# Altium schematic sheet LCD.SchDoc
size B
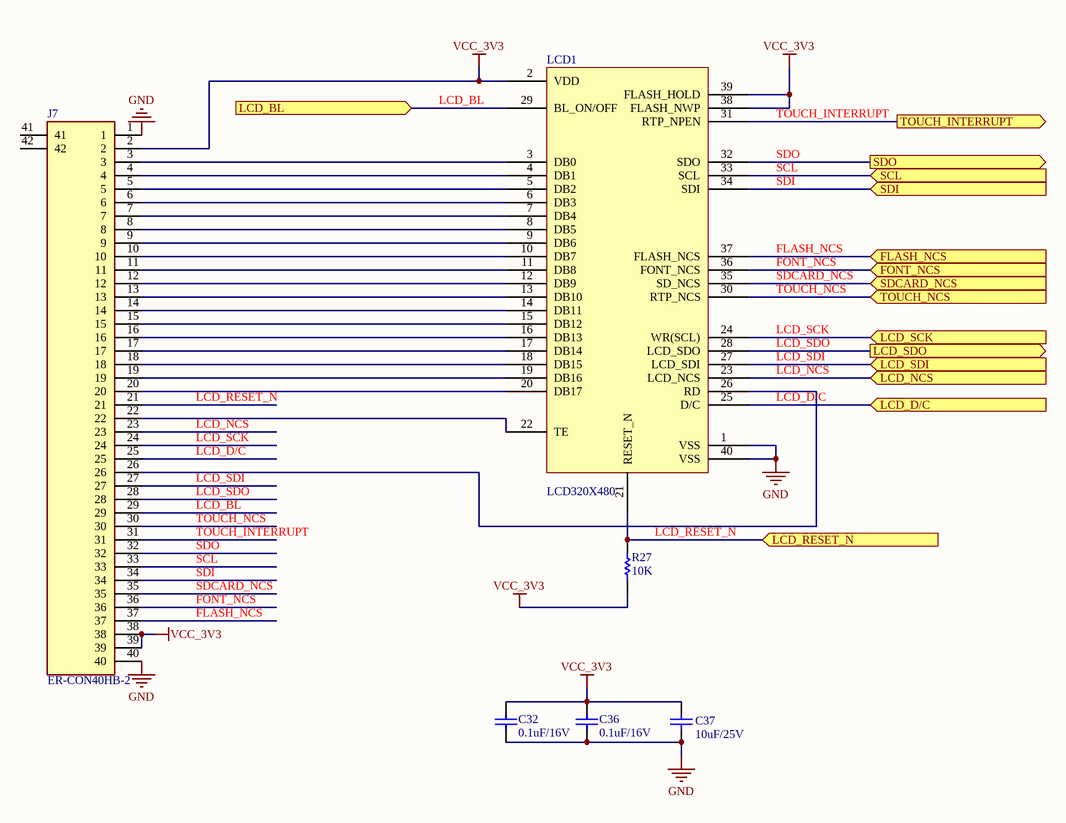
[diagram p0: LCD.SchDoc]

## Parts
C32  0.1uF/16V  [0603C]
C36  0.1uF/16V  [0603C]
C37  10uF/25V  [0805C]
J7  ER-CON40HB-2  [ERCON40HB2]
LCD1  LCD320X480  [HDR2X20]
R27  10K  [0603R]

## Ports
FLASH_NCS (in), FONT_NCS (in), LCD_BL (in), LCD_D/C (in), LCD_NCS (in), LCD_RESET_N (in), LCD_SCK (in), LCD_SDI (in), LCD_SDO (out), SCL (in), SDCARD_NCS (in), SDI (in), SDO (out), TOUCH_INTERRUPT (out), TOUCH_NCS (in)

## Nets
GND: C32.2 C36.2 C37.1 J7.1 J7.40 LCD1.1(VSS) LCD1.40(VSS)
VCC_3V3: C32.1 C36.1 C37.2 J7.2 J7.38 J7.39 LCD1.2(VDD) LCD1.38(FLASH_NWP) LCD1.39(FLASH_HOLD) R27.2
FLASH_NCS: J7.37 LCD1.37(FLASH_NCS) ; port FLASH_NCS
FONT_NCS: J7.36 LCD1.36(FONT_NCS) ; port FONT_NCS
LCD_BL: J7.29 LCD1.29(BL_ON/OFF) ; port LCD_BL
LCD_D/C: J7.25 LCD1.25(D/C) ; port LCD_D/C
LCD_NCS: J7.23 LCD1.23(LCD_NCS) ; port LCD_NCS
LCD_RESET_N: J7.21 LCD1.21(RESET_N) R27.1 ; port LCD_RESET_N
LCD_SCK: J7.24 LCD1.24(WR(SCL)) ; port LCD_SCK
LCD_SDI: J7.27 LCD1.27(LCD_SDI) ; port LCD_SDI
LCD_SDO: J7.28 LCD1.28(LCD_SDO) ; port LCD_SDO
SCL: J7.33 LCD1.33(SCL) ; port SCL
SDCARD_NCS: J7.35 LCD1.35(SD_NCS) ; port SDCARD_NCS
SDI: J7.34 LCD1.34(SDI) ; port SDI
SDO: J7.32 LCD1.32(SDO) ; port SDO
TOUCH_INTERRUPT: J7.31 LCD1.31(RTP_NPEN) ; port TOUCH_INTERRUPT
TOUCH_NCS: J7.30 LCD1.30(RTP_NCS) ; port TOUCH_NCS
NetJ7_3: J7.3 LCD1.3(DB0)
NetJ7_4: J7.4 LCD1.4(DB1)
NetJ7_5: J7.5 LCD1.5(DB2)
NetJ7_6: J7.6 LCD1.6(DB3)
NetJ7_7: J7.7 LCD1.7(DB4)
NetJ7_8: J7.8 LCD1.8(DB5)
NetJ7_9: J7.9 LCD1.9(DB6)
NetJ7_10: J7.10 LCD1.10(DB7)
NetJ7_11: J7.11 LCD1.11(DB8)
NetJ7_12: J7.12 LCD1.12(DB9)
NetJ7_13: J7.13 LCD1.13(DB10)
NetJ7_14: J7.14 LCD1.14(DB11)
NetJ7_15: J7.15 LCD1.15(DB12)
NetJ7_16: J7.16 LCD1.16(DB13)
NetJ7_17: J7.17 LCD1.17(DB14)
NetJ7_18: J7.18 LCD1.18(DB15)
NetJ7_19: J7.19 LCD1.19(DB16)
NetJ7_20: J7.20 LCD1.20(DB17)
NetJ7_22: J7.22 LCD1.22(TE)
NetJ7_26: J7.26 LCD1.26(RD)

Not connected (* = marked no-connect by the designer): J7 41 42

## Library data of the parts
C32 C36 = Cap: Multilayer Ceramic Capacitors MLCC - SMD/SMT 0603 16VDC 0.1uF 10% X7R AEC-Q2000; Mfr: Taiyo Yuden; Mfr Part No: EMK107B7104KAHT; Package: 0603; Price: 0.101; Stockiest: MOUSER; Stockiest Part No: 963-EMK107B7104KAHT; Value: 0.1uF/16V
C37 = Cap: Multilayer Ceramic Capacitors MLCC - SMD/SMT 0805 25VDC 10uF 20% X5R; Mfr: Taiyo Yuden; Mfr Part No: TMK212BBJ106MG-T; Package: 0805; Price: 0.232; Stockiest: MOUSER; Stockiest Part No: 963-TMK212BBJ106MG-T; Value: 10uF/25V
J7 = ER-CON40HB-2: 40 Pin 1.0mm Pitch Bottom Contact ZIF Connector,FPC Connector
LCD1 = ER-TFTM035-6: Mfr: Buy LCD; Mfr Part No: ER-TFTM035-6; Price: 17; Stockiest: BUY LCD; Stockiest Part No: ER-TFTM035-6; Value: 320x480
R27 = Res1: Thick Film Resistors - SMD 0603 10Kohms 1% Anti-Sulfur AEC-Q200; Mfr: ROHM Semiconductor; Mfr Part No: SFR03EZPF1002; Package: 0603; Price: 0.101; Stockiest: MOUSER; Stockiest Part No: 755-SFR03EZPF1002; Value: 10K